# EAGLE schematic schmeatic (EAGLE 7.4.0)
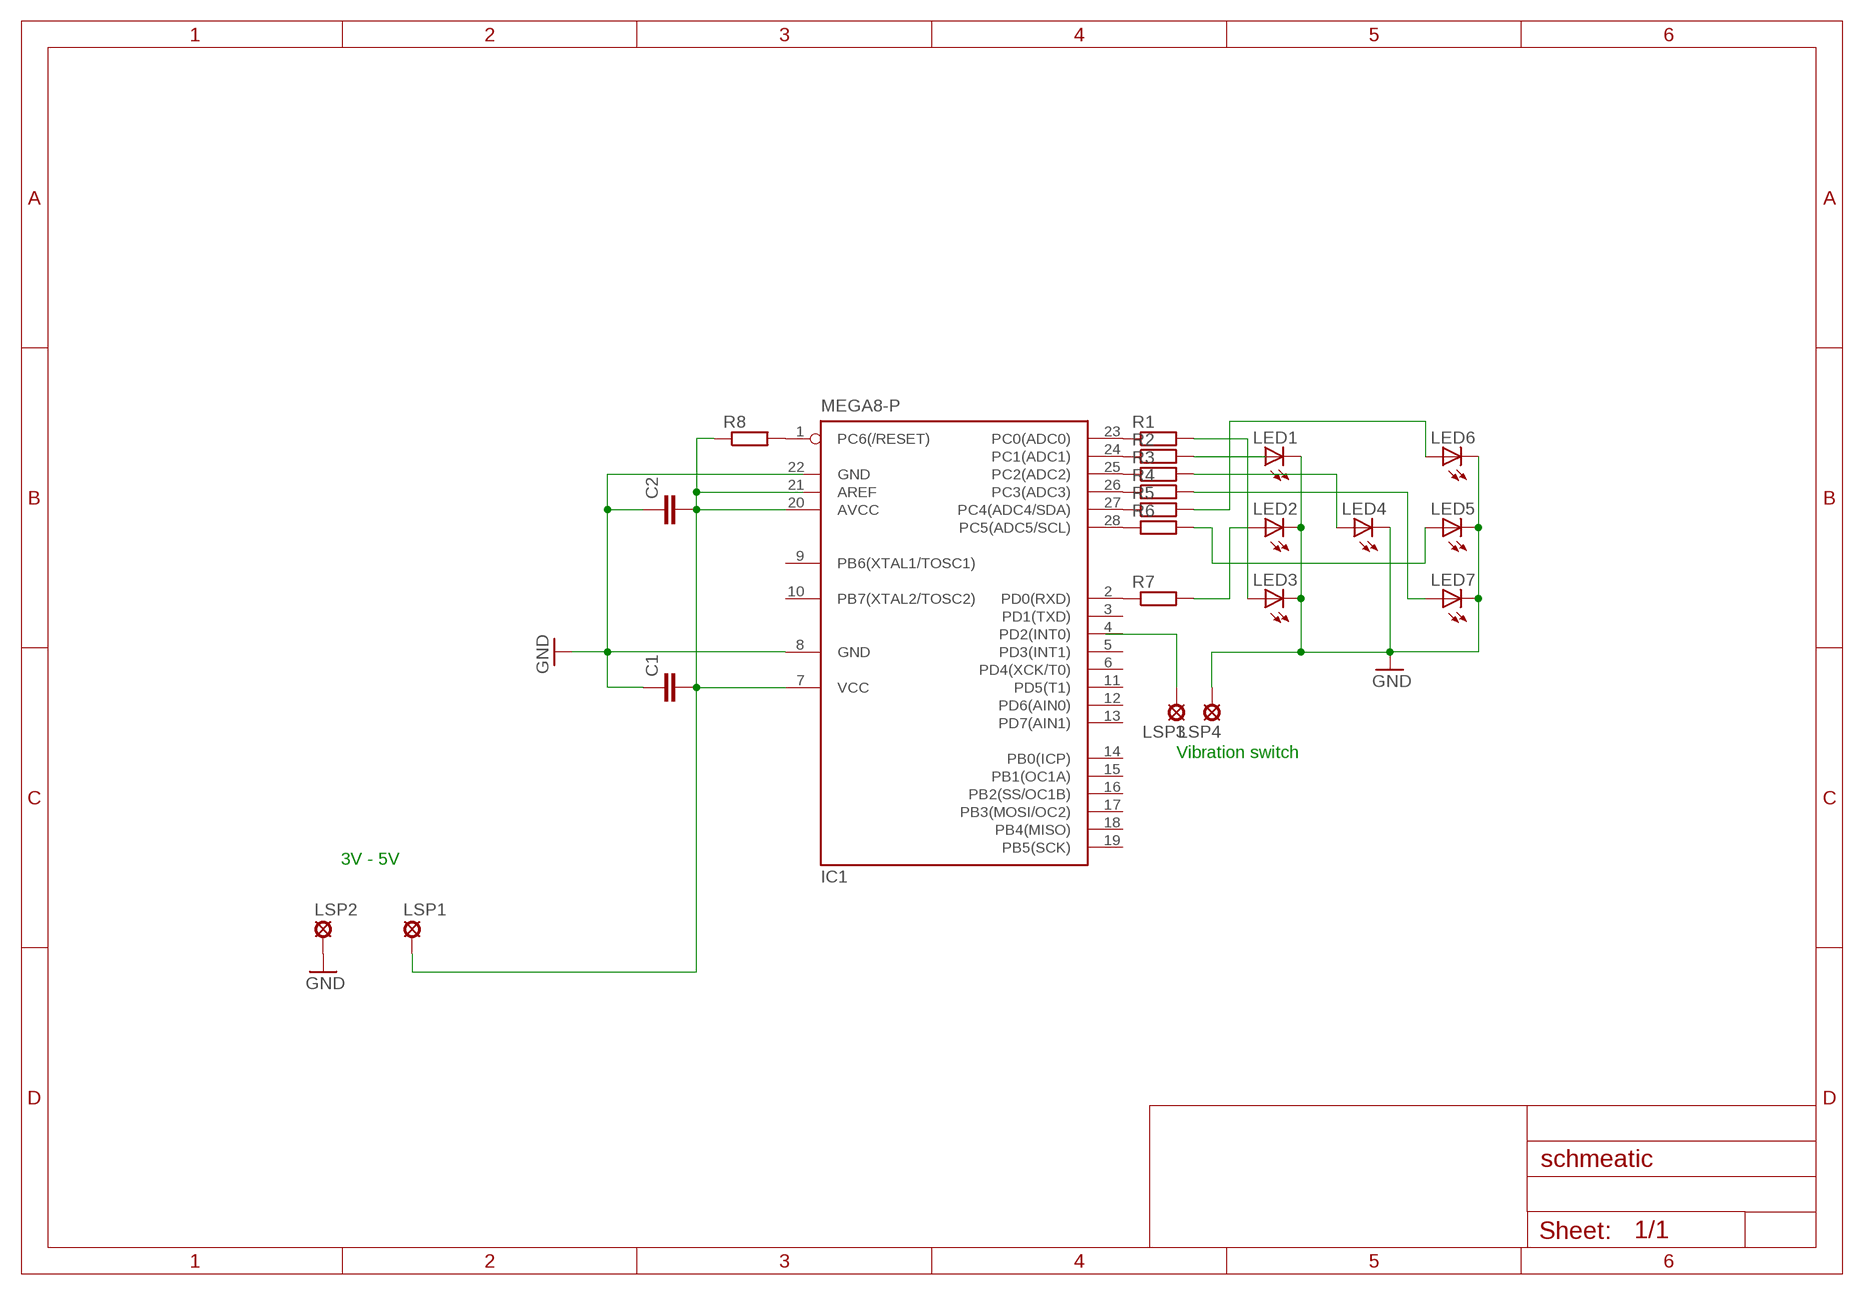
[diagram p0: schematic, sheet 1]

## Parts
C1  C2.5/5  [C2.5-5]
C2  C2.5/5  [C2.5-5]
IC1  MEGA8-P  [DIL28-3]
LED1  LED  [SMARTLED-TTW]
LED2  LED  [SMARTLED-TTW]
LED3  LED  [SMARTLED-TTW]
LED4  LED  [SMARTLED-TTW]
LED5  LED  [SMARTLED-TTW]
LED6  LED  [SMARTLED-TTW]
LED7  LED  [SMARTLED-TTW]
LSP1  LSP10  [LSP10]
LSP2  LSP10  [LSP10]
LSP3  LSP10  [LSP10]
LSP4  LSP10  [LSP10]
R1  R-EU_0207/12  [0207/12]
R2  R-EU_0207/12  [0207/12]
R3  R-EU_0207/12  [0207/12]
R4  R-EU_0207/12  [0207/12]
R5  R-EU_0207/12  [0207/12]
R6  R-EU_0207/12  [0207/12]
R7  R-EU_0207/12  [0207/12]
R8  R-EU_0309/12  [0309/12]

## Nets
GND: C1.1 C2.1 IC1.8(GND) LED1.C@1(C) LED2.C@1(C) LED3.C@1(C) LED4.C@1(C) LED5.C@1(C) LED6.C@1(C) LED7.C@1(C) LSP2.MP LSP4.MP
N$1: C1.2 C2.2 IC1.7(VCC) IC1.20(AVCC) LSP1.MP R8.1
N$2: IC1.24(PC1(ADC1)) R2.1
N$3: LED6.A@1(A) R5.2
N$4: LED2.A@1(A) R7.2
N$5: LED4.A@1(A) R3.2
N$6: LED5.A@1(A) R6.2
N$7: LED3.A@1(A) R1.2
N$8: LED7.A@1(A) R4.2
N$9: IC1.23(PC0(ADC0)) R1.1
N$10: R2.2
N$11: IC1.25(PC2(ADC2)) R3.1
N$12: IC1.26(PC3(ADC3)) R4.1
N$13: IC1.27(PC4(ADC4/SDA)) R5.1
N$14: IC1.28(PC5(ADC5/SCL)) R6.1
N$15: IC1.2(PD0(RXD)) R7.1
N$16: IC1.1(PC6(/RESET)) R8.2
N$17: LSP3.MP
Unconnected: IC1.3(PD1(TXD)) IC1.4(PD2(INT0)) IC1.5(PD3(INT1)) IC1.6(PD4(XCK/T0)) IC1.9(PB6(XTAL1/TOSC1)) IC1.10(PB7(XTAL2/TOSC2)) IC1.11(PD5(T1)) IC1.12(PD6(AIN0)) IC1.13(PD7(AIN1)) IC1.14(PB0(ICP)) IC1.15(PB1(OC1A)) IC1.16(PB2(SS/OC1B)) IC1.17(PB3(MOSI/OC2)) IC1.18(PB4(MISO)) IC1.19(PB5(SCK)) IC1.21(AREF) LED1.A@1(A)

## Notes on the sheet
- Vibration switch
- 3V - 5V

## Power pins joined to a net without a drawn wire
GND: IC1.22(GND)

## Library data of the parts
C1 C2 = capacitor-wima:C: CAPACITOR naming: grid - package width
IC1 = atmel:MEGA8-P: MICROCONTROLLER 8 Kbytes FLASH, 1 kbytes SRAM, 512 bytes EEPROM, USART, 4-channel 10 bit ADC, 2-channel 8 bit ADC Pin compatible with Atmega48, ATMega88, ATMega168 Source: avr.lbr; OC_FARNELL: unknown; OC_NEWARK: unknown
LED1-LED7 = led:LED: LED OSRAM: - CHIPLED LG R971, LG N971, LY N971, LG Q971, LY Q971, LO R971, LY R971 LH N974, LH R974 LS Q976, LO Q976, LY Q976 LO Q996 - Hyper CHIPLED LW Q18S LB Q993, LB Q99A, LB R99A - SideLED LS A670, LO A670, LY A670, LG A670, LP A670 LB A673, LV A673, LT A673, LW A673 LH A674 LY A675 LS A676, LA A676, LO A676, LY A676, LW A676 LS A679, LY A679, LG A679 - Hyper Micro SIDELED® LS Y876, LA Y876, LO Y876, LY Y876 LT Y87S - SmartLED LW L88C, LW L88S LB L89C, LB L89S, LG L890 LS L89K, LO L89K, LY L89K LS L896, LA L896, LO L896, LY L896 - TOPLED LS T670, LO T670, LY T670, LG T670, LP T670 LSG T670, LSP T670, LSY T670, LOP T670, LYG T670 LG T671, LOG T671, LSG T671 LB T673, LV T673, LT T673, LW T673 LH T674 LS T676, LA T676, LO T676, LY T676, LB T676, LH T676, LSB T676, LW T676 LB T67C, LV T67C, LT T67C, LS T67K, LO T67K, LY T67K, LW E67C LS E67B, LA E67B, LO E67B, LY E67B, LB E67C, LV E67C, LT E67C LW T67C LS T679, LY T679, LG T679 LS T770, LO T770, LY T770, LG T770, LP T770 LB T773, LV T773, LT T773, LW T773 LH T774 LS E675, LA E675, LY E675, LS T675 LS T776, LA T776, LO T776, LY T776, LB T776 LHGB T686 LT T68C, LB T68C - Hyper Mini TOPLED® LB M676 - Mini TOPLED Santana® LG M470 LS M47K, LO M47K, LY M47K Source: http://www.osram.convergy.de LUXEON: - LUMILED® LXK2-PW12-R00, LXK2-PW12-S00, LXK2-PW14-U00, LXK2-PW14-V00 LXK2-PM12-R00, LXK2-PM12-S00, LXK2-PM14-U00 LXK2-PE12-Q00, LXK2-PE12-R00, LXK2-PE12-S00, LXK2-PE14-T00, LXK2-PE14-U00 LXK2-PB12-K00, LXK2-PB12-L00, LXK2-PB12-M00, LXK2-PB14-N00, LXK2-PB14-P00, LXK2-PB14-Q00 LXK2-PR12-L00, LXK2-PR12-M00, LXK2-PR14-Q00, LXK2-PR14-R00 LXK2-PD12-Q00, LXK2-PD12-R00, LXK2-PD12-S00 LXK2-PH12-R00, LXK2-PH12-S00 LXK2-PL12-P00, LXK2-PL12-Q00, LXK2-PL12-R00 Source: www.luxeon.com KINGBRIGHT: KA-3528ASYC Source: www.kingbright.com
LSP1-LSP4 = solpad:LSP10: SOLDER PAD drill 1.0 mm, distributor Buerklin, 12H555
R1-R8 = rcl:R-EU_: RESISTOR, European symbol